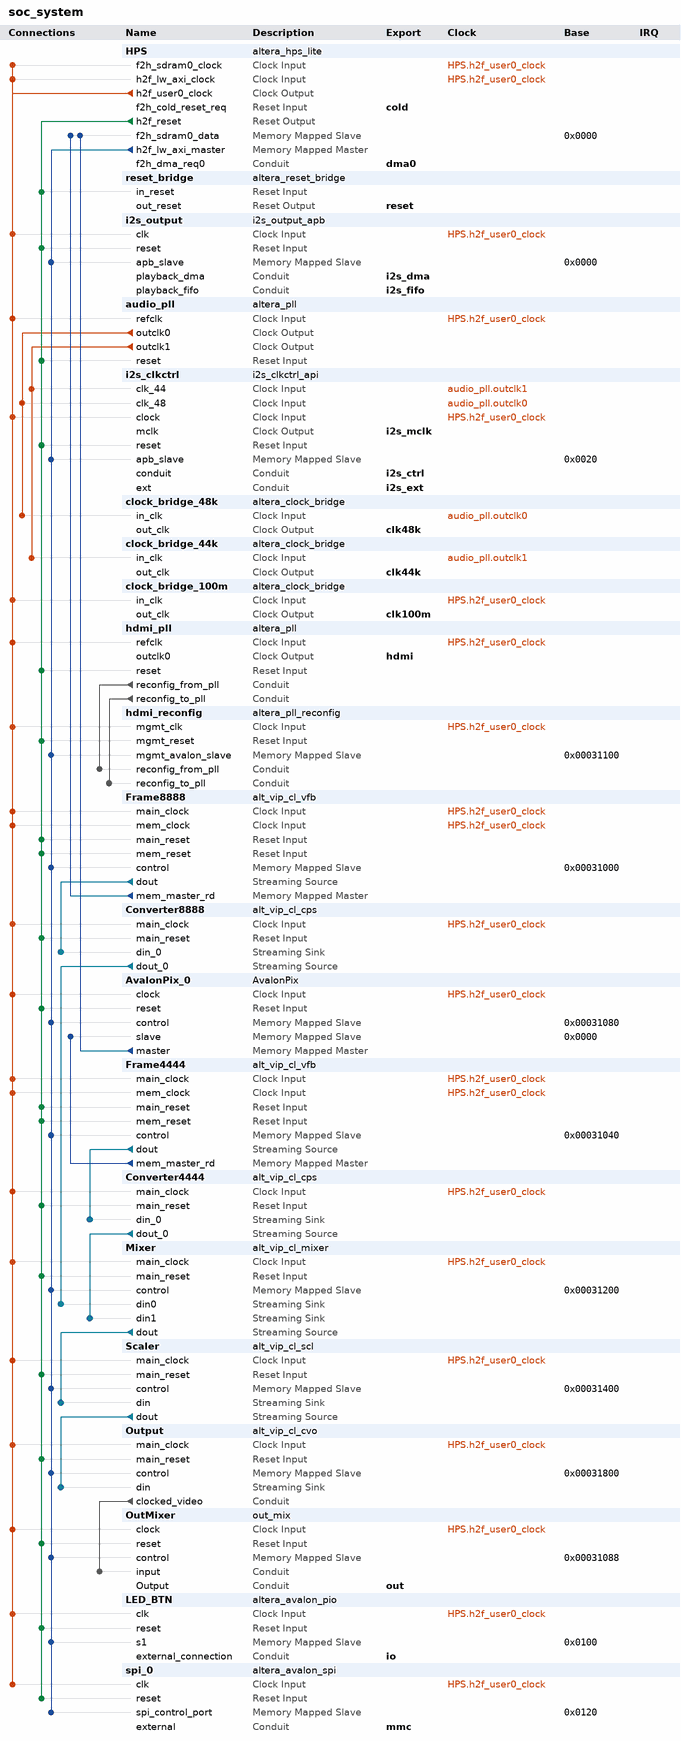
[diagram p0: system contents]
# Platform Designer (Qsys) system soc_system, Cyclone V 5CSEBA6U23I7
# Parameters at their usual value, and those the tool derives, are not listed.
package require -exact qsys 17.0
create_system soc_system
set_project_property DEVICE_FAMILY {Cyclone V}
set_project_property DEVICE 5CSEBA6U23I7

add_instance HPS altera_hps_lite 17.0
set_instance_parameter_value HPS BONDING_OUT_ENABLED false
set_instance_parameter_value HPS BOOTFROMFPGA_Enable false
set_instance_parameter_value HPS BSEL 1
set_instance_parameter_value HPS BSEL_EN false
set_instance_parameter_value HPS CAN0_Mode N/A
set_instance_parameter_value HPS CAN0_PinMuxing Unused
set_instance_parameter_value HPS CAN1_Mode N/A
set_instance_parameter_value HPS CAN1_PinMuxing Unused
set_instance_parameter_value HPS CSEL 0
set_instance_parameter_value HPS CSEL_EN false
set_instance_parameter_value HPS CTI_Enable false
set_instance_parameter_value HPS DEBUGAPB_Enable false
set_instance_parameter_value HPS DMA_Enable Yes,No,No,No,No,No,No,No
set_instance_parameter_value HPS EMAC0_Mode N/A
set_instance_parameter_value HPS EMAC0_PTP false
set_instance_parameter_value HPS EMAC0_PinMuxing Unused
set_instance_parameter_value HPS EMAC1_Mode N/A
set_instance_parameter_value HPS EMAC1_PTP false
set_instance_parameter_value HPS EMAC1_PinMuxing Unused
set_instance_parameter_value HPS F2H_AXI_CLOCK_FREQ 100
set_instance_parameter_value HPS F2H_SDRAM0_CLOCK_FREQ 100000000
set_instance_parameter_value HPS F2H_SDRAM1_CLOCK_FREQ 100
set_instance_parameter_value HPS F2H_SDRAM2_CLOCK_FREQ 100
set_instance_parameter_value HPS F2H_SDRAM3_CLOCK_FREQ 100
set_instance_parameter_value HPS F2H_SDRAM4_CLOCK_FREQ 100
set_instance_parameter_value HPS F2H_SDRAM5_CLOCK_FREQ 100
set_instance_parameter_value HPS F2SCLK_COLDRST_Enable true
set_instance_parameter_value HPS F2SCLK_DBGRST_Enable false
set_instance_parameter_value HPS F2SCLK_PERIPHCLK_Enable false
set_instance_parameter_value HPS F2SCLK_PERIPHCLK_FREQ 0
set_instance_parameter_value HPS F2SCLK_SDRAMCLK_Enable false
set_instance_parameter_value HPS F2SCLK_SDRAMCLK_FREQ 0
set_instance_parameter_value HPS F2SCLK_WARMRST_Enable false
set_instance_parameter_value HPS F2SDRAM_Type {Avalon-MM Bidirectional}
set_instance_parameter_value HPS F2SDRAM_Width 128
set_instance_parameter_value HPS F2SINTERRUPT_Enable true
set_instance_parameter_value HPS F2S_Width 0
set_instance_parameter_value HPS FPGA_PERIPHERAL_INPUT_CLOCK_FREQ_EMAC0_RX_CLK_IN 100
set_instance_parameter_value HPS FPGA_PERIPHERAL_INPUT_CLOCK_FREQ_EMAC0_TX_CLK_IN 100
set_instance_parameter_value HPS FPGA_PERIPHERAL_INPUT_CLOCK_FREQ_EMAC1_RX_CLK_IN 100
set_instance_parameter_value HPS FPGA_PERIPHERAL_INPUT_CLOCK_FREQ_EMAC1_TX_CLK_IN 100
set_instance_parameter_value HPS FPGA_PERIPHERAL_INPUT_CLOCK_FREQ_EMAC_PTP_REF_CLOCK 100
set_instance_parameter_value HPS FPGA_PERIPHERAL_INPUT_CLOCK_FREQ_I2C0_SCL_IN 100
set_instance_parameter_value HPS FPGA_PERIPHERAL_INPUT_CLOCK_FREQ_I2C1_SCL_IN 100
set_instance_parameter_value HPS FPGA_PERIPHERAL_INPUT_CLOCK_FREQ_I2C2_SCL_IN 100
set_instance_parameter_value HPS FPGA_PERIPHERAL_INPUT_CLOCK_FREQ_I2C3_SCL_IN 100
set_instance_parameter_value HPS FPGA_PERIPHERAL_INPUT_CLOCK_FREQ_SPIS0_SCLK_IN 100
set_instance_parameter_value HPS FPGA_PERIPHERAL_INPUT_CLOCK_FREQ_SPIS1_SCLK_IN 100
set_instance_parameter_value HPS FPGA_PERIPHERAL_INPUT_CLOCK_FREQ_USB0_CLK_IN 100
set_instance_parameter_value HPS FPGA_PERIPHERAL_INPUT_CLOCK_FREQ_USB1_CLK_IN 100
set_instance_parameter_value HPS FPGA_PERIPHERAL_OUTPUT_CLOCK_FREQ_EMAC0_GTX_CLK 125
set_instance_parameter_value HPS FPGA_PERIPHERAL_OUTPUT_CLOCK_FREQ_EMAC0_MD_CLK 2.5
set_instance_parameter_value HPS FPGA_PERIPHERAL_OUTPUT_CLOCK_FREQ_EMAC1_GTX_CLK 125
set_instance_parameter_value HPS FPGA_PERIPHERAL_OUTPUT_CLOCK_FREQ_EMAC1_MD_CLK 2.5
set_instance_parameter_value HPS FPGA_PERIPHERAL_OUTPUT_CLOCK_FREQ_I2C0_CLK 100
set_instance_parameter_value HPS FPGA_PERIPHERAL_OUTPUT_CLOCK_FREQ_I2C1_CLK 100
set_instance_parameter_value HPS FPGA_PERIPHERAL_OUTPUT_CLOCK_FREQ_I2C2_CLK 100
set_instance_parameter_value HPS FPGA_PERIPHERAL_OUTPUT_CLOCK_FREQ_I2C3_CLK 100
set_instance_parameter_value HPS FPGA_PERIPHERAL_OUTPUT_CLOCK_FREQ_QSPI_SCLK_OUT 100
set_instance_parameter_value HPS FPGA_PERIPHERAL_OUTPUT_CLOCK_FREQ_SDIO_CCLK 100
set_instance_parameter_value HPS FPGA_PERIPHERAL_OUTPUT_CLOCK_FREQ_SPIM0_SCLK_OUT 100
set_instance_parameter_value HPS FPGA_PERIPHERAL_OUTPUT_CLOCK_FREQ_SPIM1_SCLK_OUT 100
set_instance_parameter_value HPS GPIO_Enable No,No,No,No,No,No,No,No,No,No,No,No,No,No,No,No,No,No,No,No,No,No,No,No,No,No,No,No,No,No,No,No,No,No,No,No,No,No,No,No,No,No,No,No,No,No,No,No,No,No,No,No,No,No,No,No,No,No,No,No,No,No,No,No,No,No,No,No,No,No,No,No,No,No,No,No,No,No,No,No,No,No,No,No,No,No,No,No,No,No,No,No,No,No,No,No,No,No,No,No
set_instance_parameter_value HPS GP_Enable false
set_instance_parameter_value HPS H2F_AXI_CLOCK_FREQ 100
set_instance_parameter_value HPS H2F_CTI_CLOCK_FREQ 100
set_instance_parameter_value HPS H2F_DEBUG_APB_CLOCK_FREQ 100
set_instance_parameter_value HPS H2F_LW_AXI_CLOCK_FREQ 100000000
set_instance_parameter_value HPS H2F_TPIU_CLOCK_IN_FREQ 100
set_instance_parameter_value HPS HLGPI_Enable false
set_instance_parameter_value HPS I2C0_Mode N/A
set_instance_parameter_value HPS I2C0_PinMuxing Unused
set_instance_parameter_value HPS I2C1_Mode N/A
set_instance_parameter_value HPS I2C1_PinMuxing Unused
set_instance_parameter_value HPS I2C2_Mode N/A
set_instance_parameter_value HPS I2C2_PinMuxing Unused
set_instance_parameter_value HPS I2C3_Mode N/A
set_instance_parameter_value HPS I2C3_PinMuxing Unused
set_instance_parameter_value HPS LOANIO_Enable No,No,No,No,No,No,No,No,No,No,No,No,No,No,No,No,No,No,No,No,No,No,No,No,No,No,No,No,No,No,No,No,No,No,No,No,No,No,No,No,No,No,No,No,No,No,No,No,No,No,No,No,No,No,No,No,No,No,No,No,No,No,No,No,No,No,No,No,No,No,No,No,No,No,No,No,No,No,No,No,No,No,No,No,No,No,No,No,No,No,No,No,No,No,No,No,No,No,No,No
set_instance_parameter_value HPS LWH2F_Enable true
set_instance_parameter_value HPS MPU_EVENTS_Enable false
set_instance_parameter_value HPS NAND_Mode N/A
set_instance_parameter_value HPS NAND_PinMuxing Unused
set_instance_parameter_value HPS QSPI_Mode N/A
set_instance_parameter_value HPS QSPI_PinMuxing Unused
set_instance_parameter_value HPS S2FCLK_COLDRST_Enable false
set_instance_parameter_value HPS S2FCLK_PENDINGRST_Enable false
set_instance_parameter_value HPS S2FCLK_USER0CLK_Enable true
set_instance_parameter_value HPS S2FCLK_USER1CLK_Enable false
set_instance_parameter_value HPS S2FCLK_USER1CLK_FREQ 100.0
set_instance_parameter_value HPS S2FCLK_USER2CLK 5
set_instance_parameter_value HPS S2FCLK_USER2CLK_Enable false
set_instance_parameter_value HPS S2FCLK_USER2CLK_FREQ 100.0
set_instance_parameter_value HPS S2FINTERRUPT_CAN_Enable false
set_instance_parameter_value HPS S2FINTERRUPT_CLOCKPERIPHERAL_Enable false
set_instance_parameter_value HPS S2FINTERRUPT_CTI_Enable false
set_instance_parameter_value HPS S2FINTERRUPT_DMA_Enable false
set_instance_parameter_value HPS S2FINTERRUPT_EMAC_Enable false
set_instance_parameter_value HPS S2FINTERRUPT_FPGAMANAGER_Enable false
set_instance_parameter_value HPS S2FINTERRUPT_GPIO_Enable false
set_instance_parameter_value HPS S2FINTERRUPT_I2CEMAC_Enable false
set_instance_parameter_value HPS S2FINTERRUPT_I2CPERIPHERAL_Enable false
set_instance_parameter_value HPS S2FINTERRUPT_L4TIMER_Enable false
set_instance_parameter_value HPS S2FINTERRUPT_NAND_Enable false
set_instance_parameter_value HPS S2FINTERRUPT_OSCTIMER_Enable false
set_instance_parameter_value HPS S2FINTERRUPT_QSPI_Enable false
set_instance_parameter_value HPS S2FINTERRUPT_SDMMC_Enable false
set_instance_parameter_value HPS S2FINTERRUPT_SPIMASTER_Enable false
set_instance_parameter_value HPS S2FINTERRUPT_SPISLAVE_Enable false
set_instance_parameter_value HPS S2FINTERRUPT_UART_Enable false
set_instance_parameter_value HPS S2FINTERRUPT_USB_Enable false
set_instance_parameter_value HPS S2FINTERRUPT_WATCHDOG_Enable false
set_instance_parameter_value HPS S2F_Width 0
set_instance_parameter_value HPS SDIO_Mode N/A
set_instance_parameter_value HPS SDIO_PinMuxing Unused
set_instance_parameter_value HPS SPIM0_Mode N/A
set_instance_parameter_value HPS SPIM0_PinMuxing Unused
set_instance_parameter_value HPS SPIM1_Mode N/A
set_instance_parameter_value HPS SPIM1_PinMuxing Unused
set_instance_parameter_value HPS SPIS0_Mode N/A
set_instance_parameter_value HPS SPIS0_PinMuxing Unused
set_instance_parameter_value HPS SPIS1_Mode N/A
set_instance_parameter_value HPS SPIS1_PinMuxing Unused
set_instance_parameter_value HPS STM_Enable false
set_instance_parameter_value HPS TEST_Enable false
set_instance_parameter_value HPS TPIUFPGA_Enable false
set_instance_parameter_value HPS TPIUFPGA_alt false
set_instance_parameter_value HPS TRACE_Mode N/A
set_instance_parameter_value HPS TRACE_PinMuxing Unused
set_instance_parameter_value HPS UART0_Mode N/A
set_instance_parameter_value HPS UART0_PinMuxing Unused
set_instance_parameter_value HPS UART1_Mode N/A
set_instance_parameter_value HPS UART1_PinMuxing Unused
set_instance_parameter_value HPS USB0_Mode N/A
set_instance_parameter_value HPS USB0_PinMuxing Unused
set_instance_parameter_value HPS USB1_Mode N/A
set_instance_parameter_value HPS USB1_PinMuxing Unused
set_instance_parameter_value HPS can0_clk_div 1
set_instance_parameter_value HPS can1_clk_div 1
set_instance_parameter_value HPS configure_advanced_parameters false
set_instance_parameter_value HPS customize_device_pll_info false
set_instance_parameter_value HPS dbctrl_stayosc1 true
set_instance_parameter_value HPS dbg_at_clk_div 0
set_instance_parameter_value HPS dbg_clk_div 1
set_instance_parameter_value HPS dbg_trace_clk_div 0
set_instance_parameter_value HPS desired_can0_clk_mhz 100.0
set_instance_parameter_value HPS desired_can1_clk_mhz 100.0
set_instance_parameter_value HPS desired_cfg_clk_mhz 100.0
set_instance_parameter_value HPS desired_emac0_clk_mhz 250.0
set_instance_parameter_value HPS desired_emac1_clk_mhz 250.0
set_instance_parameter_value HPS desired_gpio_db_clk_hz 32000
set_instance_parameter_value HPS desired_l4_mp_clk_mhz 100.0
set_instance_parameter_value HPS desired_l4_sp_clk_mhz 100.0
set_instance_parameter_value HPS desired_mpu_clk_mhz 800.0
set_instance_parameter_value HPS desired_nand_clk_mhz 12.5
set_instance_parameter_value HPS desired_qspi_clk_mhz 400.0
set_instance_parameter_value HPS desired_sdmmc_clk_mhz 200.0
set_instance_parameter_value HPS desired_spi_m_clk_mhz 200.0
set_instance_parameter_value HPS desired_usb_mp_clk_mhz 200.0
set_instance_parameter_value HPS device_name 5CSEBA6U23I7
set_instance_parameter_value HPS device_pll_info_manual {{320000000 1600000000} {320000000 1000000000} {800000000 400000000 400000000}}
set_instance_parameter_value HPS eosc1_clk_mhz 25.0
set_instance_parameter_value HPS eosc2_clk_mhz 25.0
set_instance_parameter_value HPS gpio_db_clk_div 6249
set_instance_parameter_value HPS l3_mp_clk_div 1
set_instance_parameter_value HPS l3_sp_clk_div 1
set_instance_parameter_value HPS l4_mp_clk_div 1
set_instance_parameter_value HPS l4_mp_clk_source 1
set_instance_parameter_value HPS l4_sp_clk_div 1
set_instance_parameter_value HPS l4_sp_clk_source 1
set_instance_parameter_value HPS main_pll_c3 3
set_instance_parameter_value HPS main_pll_c4 3
set_instance_parameter_value HPS main_pll_c5 15
set_instance_parameter_value HPS main_pll_m 63
set_instance_parameter_value HPS main_pll_n 0
set_instance_parameter_value HPS nand_clk_source 2
set_instance_parameter_value HPS periph_pll_c0 3
set_instance_parameter_value HPS periph_pll_c1 3
set_instance_parameter_value HPS periph_pll_c2 1
set_instance_parameter_value HPS periph_pll_c3 19
set_instance_parameter_value HPS periph_pll_c4 4
set_instance_parameter_value HPS periph_pll_c5 9
set_instance_parameter_value HPS periph_pll_m 79
set_instance_parameter_value HPS periph_pll_n 1
set_instance_parameter_value HPS periph_pll_source 0
set_instance_parameter_value HPS qspi_clk_source 1
set_instance_parameter_value HPS quartus_ini_hps_emif_pll false
set_instance_parameter_value HPS quartus_ini_hps_ip_enable_all_peripheral_fpga_interfaces false
set_instance_parameter_value HPS quartus_ini_hps_ip_enable_bsel_csel false
set_instance_parameter_value HPS quartus_ini_hps_ip_enable_emac0_peripheral_fpga_interface false
set_instance_parameter_value HPS quartus_ini_hps_ip_enable_low_speed_serial_fpga_interfaces false
set_instance_parameter_value HPS quartus_ini_hps_ip_enable_test_interface false
set_instance_parameter_value HPS quartus_ini_hps_ip_f2sdram_bonding_out false
set_instance_parameter_value HPS quartus_ini_hps_ip_fast_f2sdram_sim_model false
set_instance_parameter_value HPS quartus_ini_hps_ip_suppress_sdram_synth false
set_instance_parameter_value HPS sdmmc_clk_source 2
set_instance_parameter_value HPS show_advanced_parameters false
set_instance_parameter_value HPS show_debug_info_as_warning_msg false
set_instance_parameter_value HPS show_warning_as_error_msg false
set_instance_parameter_value HPS spi_m_clk_div 0
set_instance_parameter_value HPS usb_mp_clk_div 0
set_instance_parameter_value HPS use_default_mpu_clk true

add_instance reset_bridge altera_reset_bridge 17.0
set_instance_parameter_value reset_bridge ACTIVE_LOW_RESET 1
set_instance_parameter_value reset_bridge SYNCHRONOUS_EDGES none

add_instance i2s_output i2s_output_apb 17.0

add_instance audio_pll altera_pll 17.0
set_instance_parameter_value audio_pll gui_device_speed_grade 2
set_instance_parameter_value audio_pll gui_number_of_clocks 2
set_instance_parameter_value audio_pll gui_operation_mode direct
set_instance_parameter_value audio_pll gui_output_clock_frequency0 24.576
set_instance_parameter_value audio_pll gui_output_clock_frequency1 33.8688
set_instance_parameter_value audio_pll gui_pll_mode {Fractional-N PLL}
set_instance_parameter_value audio_pll gui_reference_clock_frequency 100.0
set_instance_parameter_value audio_pll gui_use_locked false

add_instance i2s_clkctrl i2s_clkctrl_api 17.0

add_instance clock_bridge_48k altera_clock_bridge 17.0
set_instance_parameter_value clock_bridge_48k DERIVED_CLOCK_RATE 24575999
set_instance_parameter_value clock_bridge_48k EXPLICIT_CLOCK_RATE 0

add_instance clock_bridge_44k altera_clock_bridge 17.0
set_instance_parameter_value clock_bridge_44k DERIVED_CLOCK_RATE 33875025
set_instance_parameter_value clock_bridge_44k EXPLICIT_CLOCK_RATE 0

add_instance clock_bridge_100m altera_clock_bridge 17.0
set_instance_parameter_value clock_bridge_100m DERIVED_CLOCK_RATE 100000000
set_instance_parameter_value clock_bridge_100m EXPLICIT_CLOCK_RATE 0

add_instance hdmi_pll altera_pll 17.0
set_instance_parameter_value hdmi_pll gui_device_speed_grade 1
set_instance_parameter_value hdmi_pll gui_en_reconf true
set_instance_parameter_value hdmi_pll gui_number_of_clocks 1
set_instance_parameter_value hdmi_pll gui_operation_mode direct
set_instance_parameter_value hdmi_pll gui_output_clock_frequency0 148.5
set_instance_parameter_value hdmi_pll gui_pll_auto_reset On
set_instance_parameter_value hdmi_pll gui_pll_mode {Fractional-N PLL}
set_instance_parameter_value hdmi_pll gui_reference_clock_frequency 100.0
set_instance_parameter_value hdmi_pll gui_use_locked false

add_instance hdmi_reconfig altera_pll_reconfig 17.0

add_instance Frame8888 alt_vip_cl_vfb 17.0
set_instance_parameter_value Frame8888 CLOCKS_ARE_SEPARATE 1
set_instance_parameter_value Frame8888 DROP_FRAMES 1
set_instance_parameter_value Frame8888 DROP_REPEAT_USER 0
set_instance_parameter_value Frame8888 IS_FRAME_READER 1
set_instance_parameter_value Frame8888 MAX_HEIGHT 1080
set_instance_parameter_value Frame8888 MAX_WIDTH 1920
set_instance_parameter_value Frame8888 MEM_BASE_ADDR 0
set_instance_parameter_value Frame8888 MEM_BUFFER_OFFSET 16777216
set_instance_parameter_value Frame8888 MEM_PORT_WIDTH 128
set_instance_parameter_value Frame8888 NUMBER_OF_COLOR_PLANES 4
set_instance_parameter_value Frame8888 PIXELS_IN_PARALLEL 2
set_instance_parameter_value Frame8888 READER_RUNTIME_CONTROL 1
set_instance_parameter_value Frame8888 READ_BURST_TARGET 64
set_instance_parameter_value Frame8888 READ_FIFO_DEPTH 512
set_instance_parameter_value Frame8888 USER_PACKETS_MAX_STORAGE 0
set_instance_parameter_value Frame8888 USE_BUFFER_OFFSET 0
set_instance_parameter_value Frame8888 WRITE_BURST_TARGET 64
set_instance_parameter_value Frame8888 WRITE_FIFO_DEPTH 512

add_instance Converter8888 alt_vip_cl_cps 17.0
set_instance_parameter_value Converter8888 BITS_PER_SYMBOL 8
set_instance_parameter_value Converter8888 EXTRA_PIPELINING 0
set_instance_parameter_value Converter8888 INPUT_0_COLOR_PLANES_ARE_IN_PARALLEL 1
set_instance_parameter_value Converter8888 INPUT_0_FIFO 0
set_instance_parameter_value Converter8888 INPUT_0_FIFO_SIZE 8
set_instance_parameter_value Converter8888 INPUT_0_NUMBER_OF_COLOR_PLANES 4
set_instance_parameter_value Converter8888 INPUT_0_PATTERN C0,C1,C2,A0
set_instance_parameter_value Converter8888 INPUT_0_PIXELS_IN_PARALLEL 2
set_instance_parameter_value Converter8888 INPUT_0_TWO_PIXELS_PATTERN 0
set_instance_parameter_value Converter8888 INPUT_1_COLOR_PLANES_ARE_IN_PARALLEL 1
set_instance_parameter_value Converter8888 INPUT_1_FIFO 0
set_instance_parameter_value Converter8888 INPUT_1_FIFO_SIZE 8
set_instance_parameter_value Converter8888 INPUT_1_NUMBER_OF_COLOR_PLANES 3
set_instance_parameter_value Converter8888 INPUT_1_PATTERN C0,C1,C2
set_instance_parameter_value Converter8888 INPUT_1_PIXELS_IN_PARALLEL 1
set_instance_parameter_value Converter8888 INPUT_1_TWO_PIXELS_PATTERN 0
set_instance_parameter_value Converter8888 INPUT_VALIDATION 1
set_instance_parameter_value Converter8888 NUMBER_OF_INPUTS 1
set_instance_parameter_value Converter8888 NUMBER_OF_OUTPUTS 1
set_instance_parameter_value Converter8888 OUTPUT_0_COLOR_PLANES_ARE_IN_PARALLEL 1
set_instance_parameter_value Converter8888 OUTPUT_0_FIFO 0
set_instance_parameter_value Converter8888 OUTPUT_0_FIFO_SIZE 8
set_instance_parameter_value Converter8888 OUTPUT_0_NUMBER_OF_COLOR_PLANES 3
set_instance_parameter_value Converter8888 OUTPUT_0_PATTERN C0,C1,C2
set_instance_parameter_value Converter8888 OUTPUT_0_PIXELS_IN_PARALLEL 2
set_instance_parameter_value Converter8888 OUTPUT_0_TWO_PIXELS_PATTERN 0
set_instance_parameter_value Converter8888 OUTPUT_1_COLOR_PLANES_ARE_IN_PARALLEL 1
set_instance_parameter_value Converter8888 OUTPUT_1_FIFO 0
set_instance_parameter_value Converter8888 OUTPUT_1_FIFO_SIZE 8
set_instance_parameter_value Converter8888 OUTPUT_1_NUMBER_OF_COLOR_PLANES 3
set_instance_parameter_value Converter8888 OUTPUT_1_PATTERN C0,C1,C2
set_instance_parameter_value Converter8888 OUTPUT_1_PIXELS_IN_PARALLEL 1
set_instance_parameter_value Converter8888 OUTPUT_1_TWO_PIXELS_PATTERN 0
set_instance_parameter_value Converter8888 OUTPUT_VALIDATION 1
set_instance_parameter_value Converter8888 USER_PACKET_SUPPORT DISCARD
set_instance_parameter_value Converter8888 USER_PKT_0_TO_0 0
set_instance_parameter_value Converter8888 USER_PKT_0_TO_1 0
set_instance_parameter_value Converter8888 USER_PKT_1_TO_0 0
set_instance_parameter_value Converter8888 USER_PKT_1_TO_1 1

add_instance AvalonPix_0 AvalonPix 17.0

add_instance Frame4444 alt_vip_cl_vfb 17.0
set_instance_parameter_value Frame4444 CLOCKS_ARE_SEPARATE 1
set_instance_parameter_value Frame4444 DROP_FRAMES 1
set_instance_parameter_value Frame4444 DROP_REPEAT_USER 0
set_instance_parameter_value Frame4444 IS_FRAME_READER 1
set_instance_parameter_value Frame4444 MAX_HEIGHT 1080
set_instance_parameter_value Frame4444 MAX_WIDTH 1920
set_instance_parameter_value Frame4444 MEM_BASE_ADDR 0
set_instance_parameter_value Frame4444 MEM_BUFFER_OFFSET 16777216
set_instance_parameter_value Frame4444 MEM_PORT_WIDTH 128
set_instance_parameter_value Frame4444 NUMBER_OF_COLOR_PLANES 4
set_instance_parameter_value Frame4444 PIXELS_IN_PARALLEL 2
set_instance_parameter_value Frame4444 READER_RUNTIME_CONTROL 1
set_instance_parameter_value Frame4444 READ_BURST_TARGET 64
set_instance_parameter_value Frame4444 READ_FIFO_DEPTH 512
set_instance_parameter_value Frame4444 USER_PACKETS_MAX_STORAGE 0
set_instance_parameter_value Frame4444 USE_BUFFER_OFFSET 0
set_instance_parameter_value Frame4444 WRITE_BURST_TARGET 64
set_instance_parameter_value Frame4444 WRITE_FIFO_DEPTH 512

add_instance Converter4444 alt_vip_cl_cps 17.0
set_instance_parameter_value Converter4444 BITS_PER_SYMBOL 8
set_instance_parameter_value Converter4444 EXTRA_PIPELINING 0
set_instance_parameter_value Converter4444 INPUT_0_COLOR_PLANES_ARE_IN_PARALLEL 1
set_instance_parameter_value Converter4444 INPUT_0_FIFO 0
set_instance_parameter_value Converter4444 INPUT_0_FIFO_SIZE 8
set_instance_parameter_value Converter4444 INPUT_0_NUMBER_OF_COLOR_PLANES 4
set_instance_parameter_value Converter4444 INPUT_0_PATTERN C0,C1,C2,A0
set_instance_parameter_value Converter4444 INPUT_0_PIXELS_IN_PARALLEL 2
set_instance_parameter_value Converter4444 INPUT_0_TWO_PIXELS_PATTERN 0
set_instance_parameter_value Converter4444 INPUT_1_COLOR_PLANES_ARE_IN_PARALLEL 1
set_instance_parameter_value Converter4444 INPUT_1_FIFO 0
set_instance_parameter_value Converter4444 INPUT_1_FIFO_SIZE 8
set_instance_parameter_value Converter4444 INPUT_1_NUMBER_OF_COLOR_PLANES 3
set_instance_parameter_value Converter4444 INPUT_1_PATTERN C0,C1,C2
set_instance_parameter_value Converter4444 INPUT_1_PIXELS_IN_PARALLEL 1
set_instance_parameter_value Converter4444 INPUT_1_TWO_PIXELS_PATTERN 0
set_instance_parameter_value Converter4444 INPUT_VALIDATION 1
set_instance_parameter_value Converter4444 NUMBER_OF_INPUTS 1
set_instance_parameter_value Converter4444 NUMBER_OF_OUTPUTS 1
set_instance_parameter_value Converter4444 OUTPUT_0_COLOR_PLANES_ARE_IN_PARALLEL 1
set_instance_parameter_value Converter4444 OUTPUT_0_FIFO 0
set_instance_parameter_value Converter4444 OUTPUT_0_FIFO_SIZE 8
set_instance_parameter_value Converter4444 OUTPUT_0_NUMBER_OF_COLOR_PLANES 3
set_instance_parameter_value Converter4444 OUTPUT_0_PATTERN C0,C1,C2
set_instance_parameter_value Converter4444 OUTPUT_0_PIXELS_IN_PARALLEL 2
set_instance_parameter_value Converter4444 OUTPUT_0_TWO_PIXELS_PATTERN 0
set_instance_parameter_value Converter4444 OUTPUT_1_COLOR_PLANES_ARE_IN_PARALLEL 1
set_instance_parameter_value Converter4444 OUTPUT_1_FIFO 0
set_instance_parameter_value Converter4444 OUTPUT_1_FIFO_SIZE 8
set_instance_parameter_value Converter4444 OUTPUT_1_NUMBER_OF_COLOR_PLANES 3
set_instance_parameter_value Converter4444 OUTPUT_1_PATTERN C0,C1,C2
set_instance_parameter_value Converter4444 OUTPUT_1_PIXELS_IN_PARALLEL 1
set_instance_parameter_value Converter4444 OUTPUT_1_TWO_PIXELS_PATTERN 0
set_instance_parameter_value Converter4444 OUTPUT_VALIDATION 1
set_instance_parameter_value Converter4444 USER_PACKET_SUPPORT DISCARD
set_instance_parameter_value Converter4444 USER_PKT_0_TO_0 0
set_instance_parameter_value Converter4444 USER_PKT_0_TO_1 0
set_instance_parameter_value Converter4444 USER_PKT_1_TO_0 0
set_instance_parameter_value Converter4444 USER_PKT_1_TO_1 1

add_instance Mixer alt_vip_cl_mixer 17.0
set_instance_parameter_value Mixer ALPHA_ENABLE 0
set_instance_parameter_value Mixer ALPHA_STREAMS_ENABLE 0
set_instance_parameter_value Mixer BITS_PER_SYMBOL 8
set_instance_parameter_value Mixer COLOR_PLANES_ARE_IN_PARALLEL 1
set_instance_parameter_value Mixer COLOR_SPACE RGB
set_instance_parameter_value Mixer FAMILY {Cyclone V}
set_instance_parameter_value Mixer IS_422 1
set_instance_parameter_value Mixer LAYER_POSITION_ENABLE 0
set_instance_parameter_value Mixer MAX_HEIGHT 1080
set_instance_parameter_value Mixer MAX_WIDTH 1920
set_instance_parameter_value Mixer NO_OF_INPUTS 2
set_instance_parameter_value Mixer NUMBER_OF_COLOR_PLANES 2
set_instance_parameter_value Mixer PATTERN uniform
set_instance_parameter_value Mixer PIPELINE_READY 0
set_instance_parameter_value Mixer PIXELS_IN_PARALLEL 2
set_instance_parameter_value Mixer UNIFORM_VALUE_BCR 0
set_instance_parameter_value Mixer UNIFORM_VALUE_GCB 0
set_instance_parameter_value Mixer UNIFORM_VALUE_RY 0
set_instance_parameter_value Mixer USER_PACKET_FIFO_DEPTH 0
set_instance_parameter_value Mixer USER_PACKET_SUPPORT DISCARD

add_instance Scaler alt_vip_cl_scl 17.0
set_instance_parameter_value Scaler ALGORITHM_NAME POLYPHASE
set_instance_parameter_value Scaler ALWAYS_DOWNSCALE 0
set_instance_parameter_value Scaler ARE_IDENTICAL 1
set_instance_parameter_value Scaler BITS_PER_SYMBOL 8
set_instance_parameter_value Scaler DEFAULT_EDGE_THRESH 7
set_instance_parameter_value Scaler DEFAULT_LOWER_BLUR 0
set_instance_parameter_value Scaler DEFAULT_UPPER_BLUR 0
set_instance_parameter_value Scaler ENABLE_FIR 0
set_instance_parameter_value Scaler EXTRA_PIPELINING 0
set_instance_parameter_value Scaler FAMILY {Cyclone V}
set_instance_parameter_value Scaler H_BANKS 1
set_instance_parameter_value Scaler H_COEFF_FILE {<enter file name (including full path)>}
set_instance_parameter_value Scaler H_FRACTION_BITS 7
set_instance_parameter_value Scaler H_FUNCTION LANCZOS_2
set_instance_parameter_value Scaler H_INTEGER_BITS 1
set_instance_parameter_value Scaler H_PHASES 16
set_instance_parameter_value Scaler H_SIGNED 1
set_instance_parameter_value Scaler H_SYMMETRIC 0
set_instance_parameter_value Scaler H_TAPS 8
set_instance_parameter_value Scaler IS_420 0
set_instance_parameter_value Scaler IS_422 0
set_instance_parameter_value Scaler LIMITED_READBACK 1
set_instance_parameter_value Scaler LOAD_AT_RUNTIME 0
set_instance_parameter_value Scaler MAX_IN_HEIGHT 1080
set_instance_parameter_value Scaler MAX_IN_WIDTH 1920
set_instance_parameter_value Scaler MAX_OUT_HEIGHT 1080
set_instance_parameter_value Scaler MAX_OUT_WIDTH 1920
set_instance_parameter_value Scaler NO_BLANKING 0
set_instance_parameter_value Scaler PIXELS_IN_PARALLEL 2
set_instance_parameter_value Scaler PRESERVE_BITS 0
set_instance_parameter_value Scaler RUNTIME_CONTROL 1
set_instance_parameter_value Scaler SYMBOLS_IN_PAR 3
set_instance_parameter_value Scaler SYMBOLS_IN_SEQ 1
set_instance_parameter_value Scaler USER_PACKET_FIFO_DEPTH 0
set_instance_parameter_value Scaler USER_PACKET_SUPPORT DISCARD
set_instance_parameter_value Scaler V_BANKS 1
set_instance_parameter_value Scaler V_COEFF_FILE {<enter file name (including full path)>}
set_instance_parameter_value Scaler V_FRACTION_BITS 7
set_instance_parameter_value Scaler V_FUNCTION LANCZOS_2
set_instance_parameter_value Scaler V_INTEGER_BITS 1
set_instance_parameter_value Scaler V_PHASES 32
set_instance_parameter_value Scaler V_SIGNED 1
set_instance_parameter_value Scaler V_SYMMETRIC 0
set_instance_parameter_value Scaler V_TAPS 4

add_instance Output alt_vip_cl_cvo 17.0
set_instance_parameter_value Output ACCEPT_COLOURS_IN_SEQ 0
set_instance_parameter_value Output ANC_LINE 0
set_instance_parameter_value Output AP_LINE 0
set_instance_parameter_value Output BPS 8
set_instance_parameter_value Output CLOCKS_ARE_SAME 0
set_instance_parameter_value Output COLOUR_PLANES_ARE_IN_PARALLEL 1
set_instance_parameter_value Output CONTEXT_WIDTH 8
set_instance_parameter_value Output DST_WIDTH 8
set_instance_parameter_value Output FIELD0_ANC_LINE 0
set_instance_parameter_value Output FIELD0_V_BACK_PORCH 0
set_instance_parameter_value Output FIELD0_V_BLANK 0
set_instance_parameter_value Output FIELD0_V_FRONT_PORCH 0
set_instance_parameter_value Output FIELD0_V_RISING_EDGE 0
set_instance_parameter_value Output FIELD0_V_SYNC_LENGTH 0
set_instance_parameter_value Output FIFO_DEPTH 1920
set_instance_parameter_value Output F_FALLING_EDGE 0
set_instance_parameter_value Output F_RISING_EDGE 0
set_instance_parameter_value Output GENERATE_SYNC 0
set_instance_parameter_value Output H_ACTIVE_PIXELS 1920
set_instance_parameter_value Output H_BACK_PORCH 148
set_instance_parameter_value Output H_BLANK 0
set_instance_parameter_value Output H_FRONT_PORCH 88
set_instance_parameter_value Output H_SYNC_LENGTH 44
set_instance_parameter_value Output INTERLACED 0
set_instance_parameter_value Output LOW_LATENCY 1
set_instance_parameter_value Output NO_OF_CHANNELS 1
set_instance_parameter_value Output NO_OF_MODES 1
set_instance_parameter_value Output NUMBER_OF_COLOUR_PLANES 3
set_instance_parameter_value Output PIXELS_IN_PARALLEL 2
set_instance_parameter_value Output SRC_WIDTH 8
set_instance_parameter_value Output STD_WIDTH 1
set_instance_parameter_value Output TASK_WIDTH 8
set_instance_parameter_value Output THRESHOLD 1919
set_instance_parameter_value Output USE_CONTROL 1
set_instance_parameter_value Output USE_EMBEDDED_SYNCS 0
set_instance_parameter_value Output V_ACTIVE_LINES 1080
set_instance_parameter_value Output V_BACK_PORCH 36
set_instance_parameter_value Output V_BLANK 0
set_instance_parameter_value Output V_FRONT_PORCH 4
set_instance_parameter_value Output V_SYNC_LENGTH 5

add_instance OutMixer out_mix 17.0

add_instance LED_BTN altera_avalon_pio 17.0
set_instance_parameter_value LED_BTN bitClearingEdgeCapReg true
set_instance_parameter_value LED_BTN bitModifyingOutReg true
set_instance_parameter_value LED_BTN captureEdge true
set_instance_parameter_value LED_BTN direction InOut
set_instance_parameter_value LED_BTN width 16

add_instance spi_0 altera_avalon_spi 17.0
set_instance_parameter_value spi_0 clockPhase 1
set_instance_parameter_value spi_0 clockPolarity 1
set_instance_parameter_value spi_0 dataWidth 8
set_instance_parameter_value spi_0 insertSync true
set_instance_parameter_value spi_0 masterSPI true
set_instance_parameter_value spi_0 numberOfSlaves 1
set_instance_parameter_value spi_0 targetClockRate 1000000

# connections
add_connection audio_pll.outclk0 clock_bridge_48k.in_clk clock
add_connection audio_pll.outclk0 i2s_clkctrl.clk_48 clock
add_connection audio_pll.outclk1 clock_bridge_44k.in_clk clock
add_connection audio_pll.outclk1 i2s_clkctrl.clk_44 clock
add_connection HPS.h2f_user0_clock audio_pll.refclk clock
add_connection HPS.h2f_user0_clock AvalonPix_0.clock clock
add_connection HPS.h2f_user0_clock clock_bridge_100m.in_clk clock
add_connection HPS.h2f_user0_clock Converter4444.main_clock clock
add_connection HPS.h2f_user0_clock Converter8888.main_clock clock
add_connection HPS.h2f_user0_clock Frame4444.main_clock clock
add_connection HPS.h2f_user0_clock Frame4444.mem_clock clock
add_connection HPS.h2f_user0_clock Frame8888.main_clock clock
add_connection HPS.h2f_user0_clock Frame8888.mem_clock clock
add_connection HPS.h2f_user0_clock hdmi_pll.refclk clock
add_connection HPS.h2f_user0_clock hdmi_reconfig.mgmt_clk clock
add_connection HPS.h2f_user0_clock HPS.f2h_sdram0_clock clock
add_connection HPS.h2f_user0_clock HPS.h2f_lw_axi_clock clock
add_connection HPS.h2f_user0_clock i2s_clkctrl.clock clock
add_connection HPS.h2f_user0_clock i2s_output.clk clock
add_connection HPS.h2f_user0_clock LED_BTN.clk clock
add_connection HPS.h2f_user0_clock Mixer.main_clock clock
add_connection HPS.h2f_user0_clock OutMixer.clock clock
add_connection HPS.h2f_user0_clock Output.main_clock clock
add_connection HPS.h2f_user0_clock Scaler.main_clock clock
add_connection HPS.h2f_user0_clock spi_0.clk clock
add_connection HPS.h2f_reset audio_pll.reset reset
add_connection HPS.h2f_reset AvalonPix_0.reset reset
add_connection HPS.h2f_reset Converter4444.main_reset reset
add_connection HPS.h2f_reset Converter8888.main_reset reset
add_connection HPS.h2f_reset Frame4444.main_reset reset
add_connection HPS.h2f_reset Frame4444.mem_reset reset
add_connection HPS.h2f_reset Frame8888.main_reset reset
add_connection HPS.h2f_reset Frame8888.mem_reset reset
add_connection HPS.h2f_reset hdmi_pll.reset reset
add_connection HPS.h2f_reset hdmi_reconfig.mgmt_reset reset
add_connection HPS.h2f_reset i2s_clkctrl.reset reset
add_connection HPS.h2f_reset i2s_output.reset reset
add_connection HPS.h2f_reset LED_BTN.reset reset
add_connection HPS.h2f_reset Mixer.main_reset reset
add_connection HPS.h2f_reset OutMixer.reset reset
add_connection HPS.h2f_reset Output.main_reset reset
add_connection HPS.h2f_reset reset_bridge.in_reset reset
add_connection HPS.h2f_reset Scaler.main_reset reset
add_connection HPS.h2f_reset spi_0.reset reset
add_connection AvalonPix_0.master HPS.f2h_sdram0_data avalon
set_connection_parameter_value AvalonPix_0.master/HPS.f2h_sdram0_data baseAddress 0x0000
add_connection Frame4444.mem_master_rd AvalonPix_0.slave avalon
set_connection_parameter_value Frame4444.mem_master_rd/AvalonPix_0.slave baseAddress 0x0000
add_connection Frame8888.mem_master_rd HPS.f2h_sdram0_data avalon
set_connection_parameter_value Frame8888.mem_master_rd/HPS.f2h_sdram0_data baseAddress 0x0000
add_connection HPS.h2f_lw_axi_master AvalonPix_0.control avalon
set_connection_parameter_value HPS.h2f_lw_axi_master/AvalonPix_0.control baseAddress 0x00031080
add_connection HPS.h2f_lw_axi_master Frame4444.control avalon
set_connection_parameter_value HPS.h2f_lw_axi_master/Frame4444.control baseAddress 0x00031040
add_connection HPS.h2f_lw_axi_master Frame8888.control avalon
set_connection_parameter_value HPS.h2f_lw_axi_master/Frame8888.control baseAddress 0x00031000
add_connection HPS.h2f_lw_axi_master hdmi_reconfig.mgmt_avalon_slave avalon
set_connection_parameter_value HPS.h2f_lw_axi_master/hdmi_reconfig.mgmt_avalon_slave baseAddress 0x00031100
add_connection HPS.h2f_lw_axi_master i2s_clkctrl.apb_slave avalon
set_connection_parameter_value HPS.h2f_lw_axi_master/i2s_clkctrl.apb_slave baseAddress 0x0020
add_connection HPS.h2f_lw_axi_master i2s_output.apb_slave avalon
set_connection_parameter_value HPS.h2f_lw_axi_master/i2s_output.apb_slave baseAddress 0x0000
add_connection HPS.h2f_lw_axi_master LED_BTN.s1 avalon
set_connection_parameter_value HPS.h2f_lw_axi_master/LED_BTN.s1 baseAddress 0x0100
add_connection HPS.h2f_lw_axi_master Mixer.control avalon
set_connection_parameter_value HPS.h2f_lw_axi_master/Mixer.control baseAddress 0x00031200
add_connection HPS.h2f_lw_axi_master OutMixer.control avalon
set_connection_parameter_value HPS.h2f_lw_axi_master/OutMixer.control baseAddress 0x00031088
add_connection HPS.h2f_lw_axi_master Output.control avalon
set_connection_parameter_value HPS.h2f_lw_axi_master/Output.control baseAddress 0x00031800
add_connection HPS.h2f_lw_axi_master Scaler.control avalon
set_connection_parameter_value HPS.h2f_lw_axi_master/Scaler.control baseAddress 0x00031400
add_connection HPS.h2f_lw_axi_master spi_0.spi_control_port avalon
set_connection_parameter_value HPS.h2f_lw_axi_master/spi_0.spi_control_port baseAddress 0x0120
add_connection Converter4444.dout_0 Mixer.din1 avalon_streaming
add_connection Converter8888.dout_0 Mixer.din0 avalon_streaming
add_connection Frame4444.dout Converter4444.din_0 avalon_streaming
add_connection Frame8888.dout Converter8888.din_0 avalon_streaming
add_connection Mixer.dout Scaler.din avalon_streaming
add_connection Scaler.dout Output.din avalon_streaming
add_connection hdmi_pll.reconfig_from_pll hdmi_reconfig.reconfig_from_pll conduit
add_connection hdmi_pll.reconfig_to_pll hdmi_reconfig.reconfig_to_pll conduit
add_connection Output.clocked_video OutMixer.input conduit

# exported interfaces
add_interface clk100m clock source
set_interface_property clk100m EXPORT_OF clock_bridge_100m.out_clk
add_interface clk44k clock source
set_interface_property clk44k EXPORT_OF clock_bridge_44k.out_clk
add_interface clk48k clock source
set_interface_property clk48k EXPORT_OF clock_bridge_48k.out_clk
add_interface cold reset sink
set_interface_property cold EXPORT_OF HPS.f2h_cold_reset_req
add_interface dma0 conduit end
set_interface_property dma0 EXPORT_OF HPS.f2h_dma_req0
add_interface hdmi clock source
set_interface_property hdmi EXPORT_OF hdmi_pll.outclk0
add_interface i2s_ctrl conduit end
set_interface_property i2s_ctrl EXPORT_OF i2s_clkctrl.conduit
add_interface i2s_dma conduit end
set_interface_property i2s_dma EXPORT_OF i2s_output.playback_dma
add_interface i2s_ext conduit end
set_interface_property i2s_ext EXPORT_OF i2s_clkctrl.ext
add_interface i2s_fifo conduit end
set_interface_property i2s_fifo EXPORT_OF i2s_output.playback_fifo
add_interface i2s_mclk clock source
set_interface_property i2s_mclk EXPORT_OF i2s_clkctrl.mclk
add_interface io conduit end
set_interface_property io EXPORT_OF LED_BTN.external_connection
add_interface mmc conduit end
set_interface_property mmc EXPORT_OF spi_0.external
add_interface out conduit end
set_interface_property out EXPORT_OF OutMixer.Output
add_interface reset reset source
set_interface_property reset EXPORT_OF reset_bridge.out_reset

set_interconnect_requirement {$system} qsys_mm.clockCrossingAdapter HANDSHAKE
set_interconnect_requirement {$system} qsys_mm.insertDefaultSlave FALSE
set_interconnect_requirement {$system} qsys_mm.maxAdditionalLatency 0

save_system soc_system.qsys
